# EAGLE design roundboard - MDBT42Q_ICM20848_new (EAGLE 9.6.2)
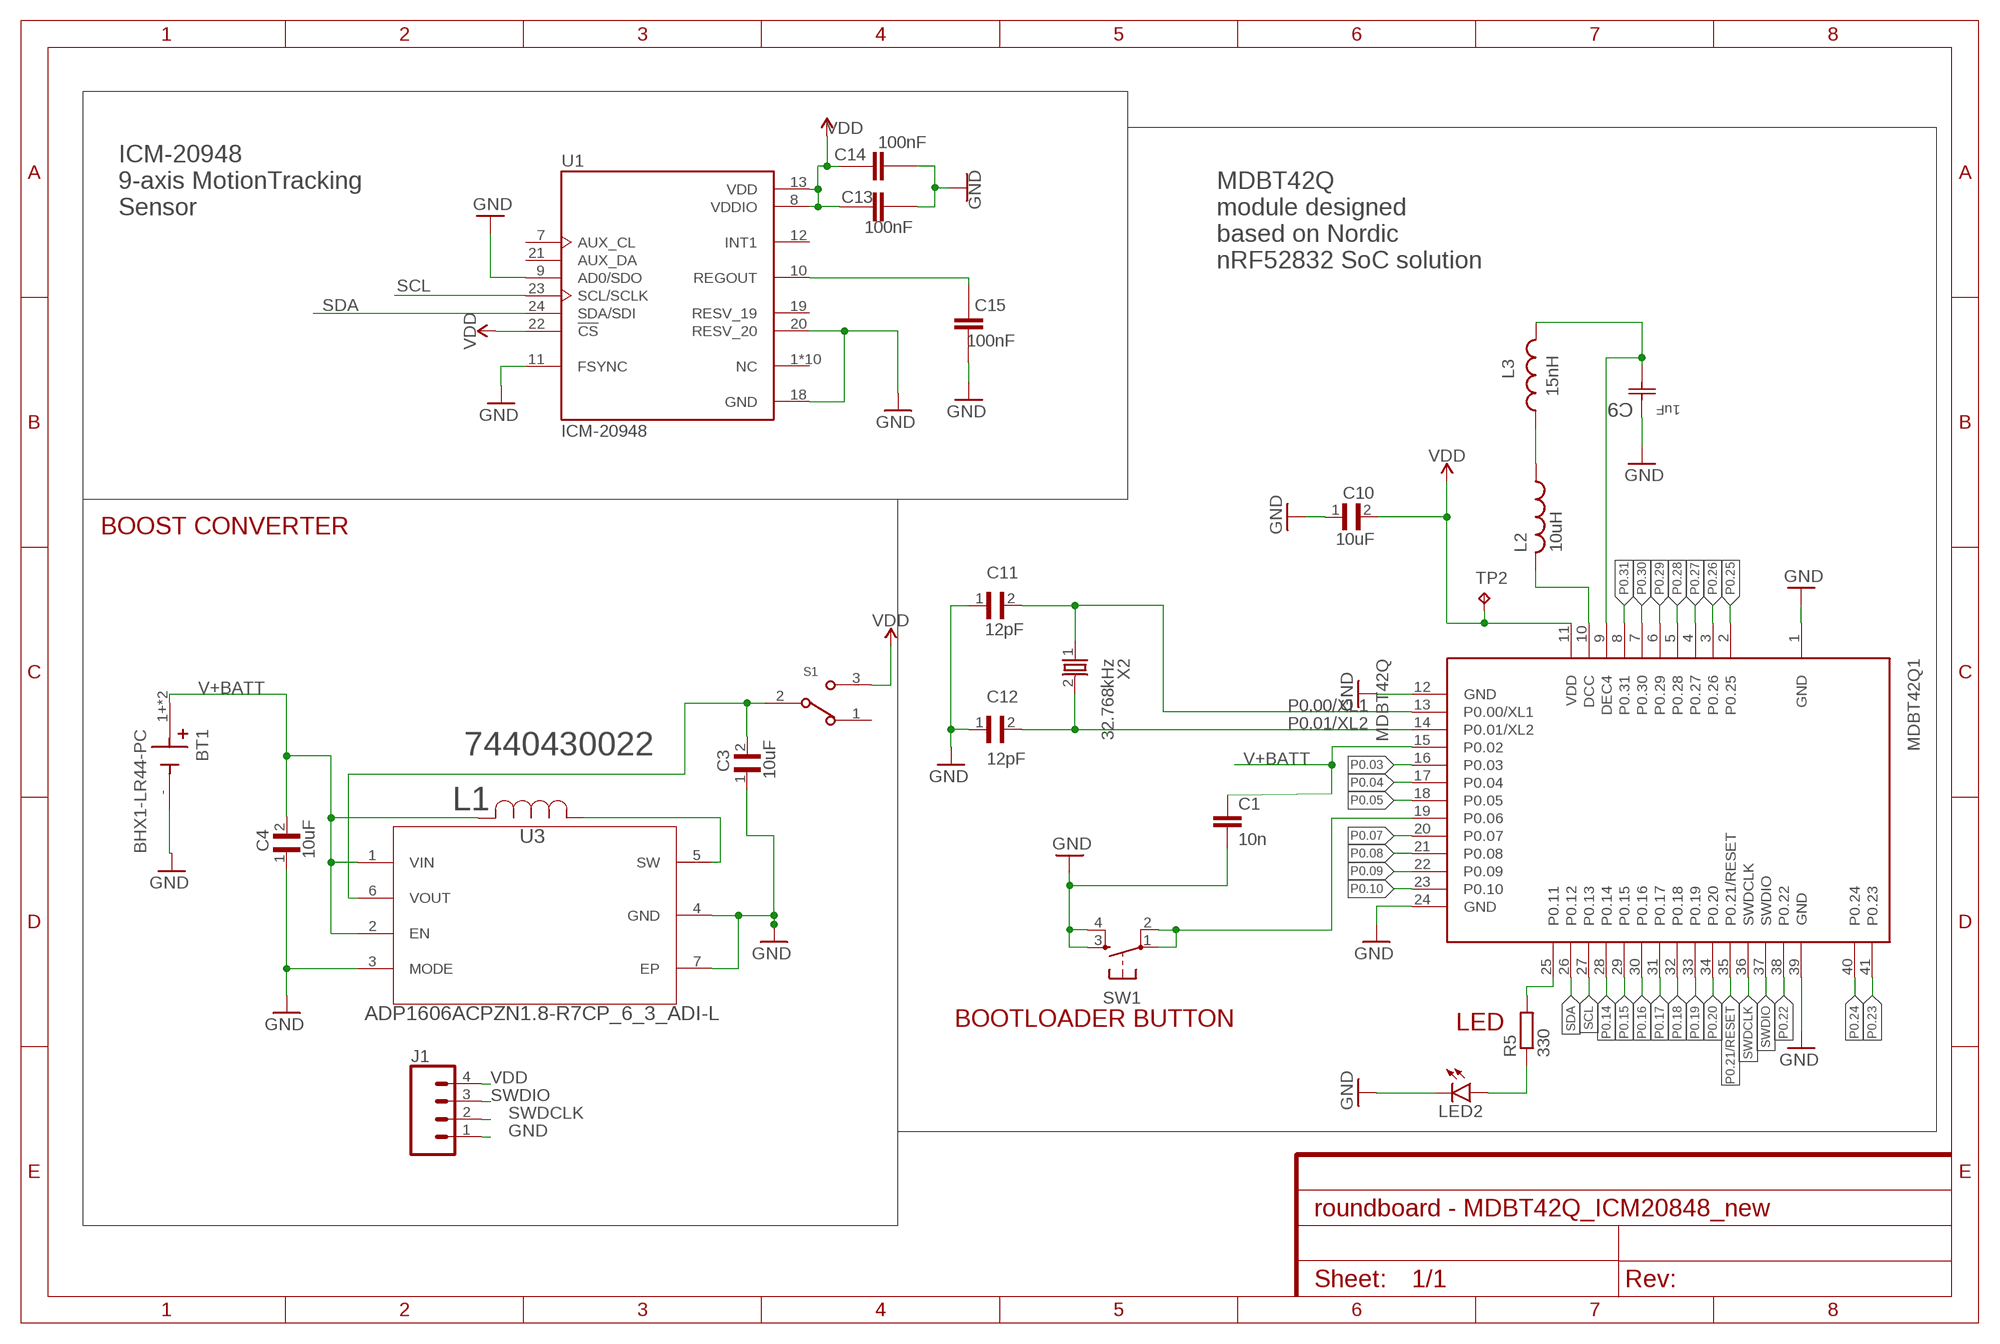
[diagram p0: schematic, sheet 1]

## Parts
BT1  BHX1-LR44-PC  [BAT_BHX1-LR44-PC]
C1  10n  C-EUC0603  [C0603]
C3  10uF  GRM188R61A106KE69J  [CAPC1608X95N]
C4  10uF  GRM188R61A106KE69J  [CAPC1608X95N]
C9  1uF  CC0603KRX7R7BB105  [CAPC1608X90N]
C10  10uF  GRM188R61A106KE69J  [CAPC1608X95N]
C11  12pF  04025A120GAT2A  [CAPC1005X56N]
C12  12pF  04025A120GAT2A  [CAPC1005X56N]
C13  100nF  CC0402KRX7R6BB104  [CAPC1005X60]
C14  100nF  CC0402KRX7R6BB104  [CAPC1005X60]
C15  100nF  CC0402KRX7R6BB104  [CAPC1005X60]
J1  CONN_04PTH  [1X04]
L1  7440430022  [IND_7440430022_WRE]
L2  10uH  INDUCTOR_0603_L  [RESC0603_L]
L3  15nH  LQG15HS15NJ02D  [INDC1005X55N]
LED2  LEDCHIPLED_0603  [CHIPLED_0603]
MDBT42Q1  MDBT42Q  [MDBT42Q]
R5  330  R-EU_R0603  [R0603]
S1  JS102011SAQN  [SW_JS102011SAQN]
SW1  SWITCH_SPST_4_PINRECT  [TACTILE_SWITCH_SMD_4.6X2.8MM]
TP2  TPB1,27  [B1,27]
U1  ICM-20948  [QFN40P300X300X105-24N]
U3  ADP1606ACPZN1.8-R7CP_6_3_ADI-L  [CP_6_3_ADI-L]
X2  32.768kHz  XTAL_32KHZ  [XTAL_3215_N]

## Nets
GND: BT1.- C1.2 C3.1 C4.1 C9.1(C1) C10.1 C11.1 C12.1 C13.1 C14.1 C15.1 J1.1 LED2.C MDBT42Q1.1(GND) MDBT42Q1.12(GND) MDBT42Q1.24(GND) MDBT42Q1.39(GND) SW1.3 SW1.4 U1.9(AD0/SDO) U1.11(FSYNC) U1.18(GND) U1.20(RESV_20) U3.3(MODE) U3.4(GND) U3.7(EP)
IND: L1.1 U3.5(SW)
N$1: LED2.A R5.1
N$2: L2.2 MDBT42Q1.10(DCC)
N$3: L2.1 L3.1
N$4: C9.2(C2) L3.2 MDBT42Q1.9(DEC4)
N$5: MDBT42Q1.25(P0.11) R5.2
N$7: C15.2 U1.10(REGOUT)
P0.00/XL1: C11.2 MDBT42Q1.13(P0.00/XL1) X2.1
P0.01/XL2: C12.2 MDBT42Q1.14(P0.01/XL2) X2.2
P0.03: MDBT42Q1.16(P0.03)
P0.04: MDBT42Q1.17(P0.04)
P0.05: MDBT42Q1.18(P0.05)
P0.07: MDBT42Q1.20(P0.07)
P0.08: MDBT42Q1.21(P0.08)
P0.09: MDBT42Q1.22(P0.09)
P0.10: MDBT42Q1.23(P0.10)
P0.14: MDBT42Q1.28(P0.14)
P0.15: MDBT42Q1.29(P0.15)
P0.16: MDBT42Q1.30(P0.16)
P0.17: MDBT42Q1.31(P0.17)
P0.18: MDBT42Q1.32(P0.18)
P0.19: MDBT42Q1.33(P0.19)
P0.20: MDBT42Q1.34(P0.20)
P0.21/RESET: MDBT42Q1.35(P0.21/RESET)
P0.22: MDBT42Q1.38(P0.22)
P0.23: MDBT42Q1.41(P0.23)
P0.24: MDBT42Q1.40(P0.24)
P0.25: MDBT42Q1.2(P0.25)
P0.26: MDBT42Q1.3(P0.26)
P0.27: MDBT42Q1.4(P0.27)
P0.28: MDBT42Q1.5(P0.28)
P0.29: MDBT42Q1.6(P0.29)
P0.30: MDBT42Q1.7(P0.30)
P0.31: MDBT42Q1.8(P0.31)
P06: MDBT42Q1.19(P0.06) SW1.1 SW1.2
SCL: MDBT42Q1.27(P0.13) U1.23(SCL/SCLK)
SDA: MDBT42Q1.26(P0.12) U1.24(SDA/SDI)
SW: C3.2 S1.2 U3.6(VOUT)
SWDCLK: J1.2 MDBT42Q1.36(SWDCLK)
SWDIO: J1.3 MDBT42Q1.37(SWDIO)
V+BATT: BT1.1+(+) BT1.2+(+) C1.1 C4.2 L1.2 MDBT42Q1.15(P0.02) U3.1(VIN) U3.2(EN)
VDD: C10.2 C13.2 C14.2 J1.4 MDBT42Q1.11(VDD) S1.3 TP2.TP U1.8(VDDIO) U1.13(VDD) U1.22(!CS)
Unconnected: S1.1 U1.1(NC) U1.2(NC) U1.3(NC) U1.4(NC) U1.5(NC) U1.6(NC) U1.7(AUX_CL) U1.12(INT1) U1.14(NC) U1.15(NC) U1.16(NC) U1.17(NC) U1.19(RESV_19) U1.21(AUX_DA)

## Notes on the sheet
- ICM-20948
  9-axis MotionTracking
  Sensor
- MDBT42Q
  module designed 
  based on Nordic 
  nRF52832 SoC solution
- BOOST CONVERTER
- BOOTLOADER BUTTON | LED

## Library data of the parts
BT1 = BHX1-LR44-PC:BHX1-LR44-PC: Battery Retainer Coin, 12.0mm 1 Cell PC Pin; DESCRIPTION: Battery Retainer Coin, 12.0mm 1 Cell PC Pin; DIGI-KEY_PART_NUMBER: BHX1-LR44-PC-G-ND; MF: MPD; MP: BHX1-LR44-PC; PACKAGE: None; PURCHASE-URL: https://pricing.snapeda.com/search/part/BHX1-LR44-PC/?ref=eda
C1 = rcl:C-EU: CAPACITOR, European symbol; SPICEPREFIX: C
C3 C4 C10 = GRM188R61A106KE69J:GRM188R61A106KE69J: Cap Ceramic 10uF 10V X5R 10% SMD 0603 85°C Paper T/R; DESCRIPTION: SMD Capacitor X5R_EIA_ with Capacitance: 10uF Tol. 10%. Rated Voltage: 10Vdc; DIGI-KEY_PART_NUMBER: 490-14372-1-ND; DIGI-KEY_PURCHASE_URL: https://www.digikey.com/product-detail/en/murata-electronics/GRM188R61A106KE69J/490-14372-1-ND/6606833?utm_source=snapeda&utm_medium=aggregator&utm_campaign=symbol; MF: Murata; MP: GRM188R61A106KE69J; PACKAGE: 1608 Murata
C9 = CC0603KRX7R7BB105:CC0603KRX7R7BB105: CAPACITOR, 0603; DESCRIPTION: 0603 1 uF 16 V ±10 % Tolerance X7R SMT Multilayer Ceramic Capacitor; DIGI-KEY_PART_NUMBER: 311-1446-1-ND; DIGI-KEY_PURCHASE_URL: https://www.digikey.com/product-detail/en/yageo/CC0603KRX7R7BB105/311-1446-1-ND/2833752?utm_source=snapeda&utm_medium=aggregator&utm_campaign=symbol; MF: Yageo; MP: CC0603KRX7R7BB105; PACKAGE: 0603 Yageo
C11 C12 = 04025A120GAT2A:04025A120GAT2A: CAP, MLCC, C0G, 12PF, 50V, 0402; DESCRIPTION: 0402 12 pF 50 V ±2% Tolerance C0G/NP0 SMT Multilayer Ceramic Capacitor; DIGI-KEY_PART_NUMBER: 478-7871-1-ND; DIGI-KEY_PURCHASE_URL: https://www.digikey.com/product-detail/en/avx-corporation/04025A120GAT2A/478-7871-1-ND/3881494?utm_source=snapeda&utm_medium=aggregator&utm_campaign=symbol; MF: AVX; MP: 04025A120GAT2A; PACKAGE: 1005 AVX
C13-C15 = CC0402KRX7R6BB104:CC0402KRX7R6BB104: Capacitor 100nF 10V 0402 SMD X7R (reel); DESCRIPTION: 0.1µF ±10% 10V Ceramic Capacitor X7R 0402 _1005 Metric_; DIGI-KEY_PART_NUMBER: 311-1345-1-ND; DIGI-KEY_PURCHASE_URL: https://www.digikey.com/product-detail/en/yageo/CC0402KRX7R6BB104/311-1345-1-ND/2103129?utm_source=snapeda&utm_medium=aggregator&utm_campaign=symbol; MF: Yageo; MP: CC0402KRX7R6BB104; PACKAGE: 0402 Yageo
J1 = SparkFun-Connectors:CONN_04: Multi connection point. Often used as Generic Header-pin footprint for 0.1 inch spaced/style header connections On any of the 0.1 inch spaced packages, you can populate with these: Break Away Headers - Straight <https://www.sparkfun.com/products/116> (PRT-00116) Break Away Male Headers - Right Angle <https://www.sparkfun.com/products/553> (PRT-00553) Female Headers <https://www.sparkfun.com/products/115> (PRT-00115) Break Away Headers - Machine Pin <https://www.sparkfun.com/products/117> (PRT-00117) Break Away Female Headers - Swiss Machine Pin <https://www.sparkfun.com/products/743> (PRT-00743) For SCREWTERMINALS and SPRING TERMINALS visit here: Screw Terimnals on SparkFun.com <https://www.sparkfun.com/search/results?term=Screw+Terminals> (5mm/3.5mm/2.54mm spacing) This device is also useful as a general connection point to wire up your design to another part of your project. Our various solder wires solder well into these plated through hole pads. Hook-Up Wire - Assortment (Stranded, 22 AWG) <https://www.sparkfun.com/products/11375> (PRT-11375) Hook-Up Wire - Assortment (Solid Core, 22 AWG) <https://www.sparkfun.com/products/11367> (PRT-11367) View the entire wire category on our website here <https://www.sparkfun.com/categories/141> Special notes: Molex polarized connector foot print use with SKU : PRT-08231 with associated crimp pins and housings. 1MM SMD Version SKU: PRT-10208; PROD_ID: CONN-09696
L1 = inductor:7440430022; BUILT_BY: EMA_Cory; COPYRIGHT: Copyright (C) 2018 Accelerated Designs. All rights reserved; DATASHEET: https://www.we-online.de/katalog/datasheet/7440430022.pdf; MANUFACTURER_PART_NUMBER: 7440430022; SOURCELIBRARY: Wurth_Electronics_2020-07-24; VENDOR: Wurth Electronics
L2 = Nordic_nRF:INDUCTOR: Generic chip inductor
L3 = LQG15HS15NJ02D:LQG15HS15NJ02D: Ind RF Chip Multi-Layer 15nH 5% 100MHz 8Q-Factor Air 300mA 0402 Paper T/R; DESCRIPTION: Inductor with Inductance: 15nH Tol. +/-5%, Package: 0402 _1005_; DIGI-KEY_PART_NUMBER: 490-2625-1-ND; DIGI-KEY_PURCHASE_URL: https://www.digikey.com/product-detail/en/murata-electronics/LQG15HS15NJ02D/490-2625-1-ND/662905?utm_source=snapeda&utm_medium=aggregator&utm_campaign=symbol; MF: Murata Electronics; MP: LQG15HS15NJ02D; PACKAGE: 1005 Murata
LED2 = led:LED: LED OSRAM: - CHIPLED LG R971, LG N971, LY N971, LG Q971, LY Q971, LO R971, LY R971 LH N974, LH R974 LS Q976, LO Q976, LY Q976 LO Q996 - Hyper CHIPLED LW Q18S LB Q993, LB Q99A, LB R99A - SideLED LS A670, LO A670, LY A670, LG A670, LP A670 LB A673, LV A673, LT A673, LW A673 LH A674 LY A675 LS A676, LA A676, LO A676, LY A676, LW A676 LS A679, LY A679, LG A679 - Hyper Micro SIDELED® LS Y876, LA Y876, LO Y876, LY Y876 LT Y87S - SmartLED LW L88C, LW L88S LB L89C, LB L89S, LG L890 LS L89K, LO L89K, LY L89K LS L896, LA L896, LO L896, LY L896 - TOPLED LS T670, LO T670, LY T670, LG T670, LP T670 LSG T670, LSP T670, LSY T670, LOP T670, LYG T670 LG T671, LOG T671, LSG T671 LB T673, LV T673, LT T673, LW T673 LH T674 LS T676, LA T676, LO T676, LY T676, LB T676, LH T676, LSB T676, LW T676 LB T67C, LV T67C, LT T67C, LS T67K, LO T67K, LY T67K, LW E67C LS E67B, LA E67B, LO E67B, LY E67B, LB E67C, LV E67C, LT E67C LW T67C LS T679, LY T679, LG T679 LS T770, LO T770, LY T770, LG T770, LP T770 LB T773, LV T773, LT T773, LW T773 LH T774 LS E675, LA E675, LY E675, LS T675 LS T776, LA T776, LO T776, LY T776, LB T776 LHGB T686 LT T68C, LB T68C - Hyper Mini TOPLED® LB M676 - Mini TOPLED Santana® LG M470 LS M47K, LO M47K, LY M47K Source: http://www.osram.convergy.de LUXEON: - LUMILED® LXK2-PW12-R00, LXK2-PW12-S00, LXK2-PW14-U00, LXK2-PW14-V00 LXK2-PM12-R00, LXK2-PM12-S00, LXK2-PM14-U00 LXK2-PE12-Q00, LXK2-PE12-R00, LXK2-PE12-S00, LXK2-PE14-T00, LXK2-PE14-U00 LXK2-PB12-K00, LXK2-PB12-L00, LXK2-PB12-M00, LXK2-PB14-N00, LXK2-PB14-P00, LXK2-PB14-Q00 LXK2-PR12-L00, LXK2-PR12-M00, LXK2-PR14-Q00, LXK2-PR14-R00 LXK2-PD12-Q00, LXK2-PD12-R00, LXK2-PD12-S00 LXK2-PH12-R00, LXK2-PH12-S00 LXK2-PL12-P00, LXK2-PL12-Q00, LXK2-PL12-R00 Source: www.luxeon.com KINGBRIGHT: KA-3528ASYC Source: www.kingbright.com
MDBT42Q1 = MDBT42Q_171016:MDBT42Q: Raytac Corporation MDBT42Q-512K, MDBT42Q-P512K Bluetooth Low Energy Module based on Noridc nRF52832 Source: Raytac datasheet
R5 = rcl:R-EU_: RESISTOR, European symbol; SPICEPREFIX: R
S1 = JS102011SAQN:JS102011SAQN: JS10 Series SPDT On-On 6 V 0.3 A Gull Wing SMT Slide Switch http://www.snapeda.com/parts/JS102011SAQN/C%26K%20Components/view-part/; DESCRIPTION: Slide Switch SPDT Surface Mount, Right Angle; DIGI-KEY_PART_NUMBER: 401-1999-1-ND; DIGI-KEY_PURCHASE_URL: https://www.digikey.com/product-detail/en/c-k/JS102011SAQN/401-1999-1-ND/1640114?utm_source=snapeda&utm_medium=aggregator&utm_campaign=symbol; MF: C&K; MP: JS102011SAQN; PACKAGE: None
SW1 = SparkFun-Electromechanical:SWITCH_SPST_4_PIN; PROD_ID: SWCH-13065
TP2 = testpad:TP: Test pad
U1 = ICM-20948:ICM-20948: Accelerometer, Gyroscope, Magnetometer, 9 Axis Sensor I²C, SPI Output Check prices <https://pricing.snapeda.com/parts/ICM-20948/TDK%20InvenSense/view-part?ref=eda>; AVAILABILITY: Good; DESCRIPTION: Accelerometer, Gyroscope, Magnetometer, 9 Axis Sensor I²C, SPI Output; MF: TDK InvenSense; MP: ICM-20948; PACKAGE: TFQFN-24 TDK InvenSense; PRICE: None; PURCHASE-URL: https://pricing.snapeda.com/search/part/ICM-20948/?ref=eda
U3 = AD1606:ADP1606ACPZN1.8-R7; BUILT_BY: EMA_UL_Team; MANUFACTURER_PART_NUMBER: ADP1606ACPZN1.8-R7; SOURCELIBRARY: Analog_2015-12-15; VENDOR: Analog Devices Inc
X2 = Nordic_nRF:XTAL_32KHZ

## Board
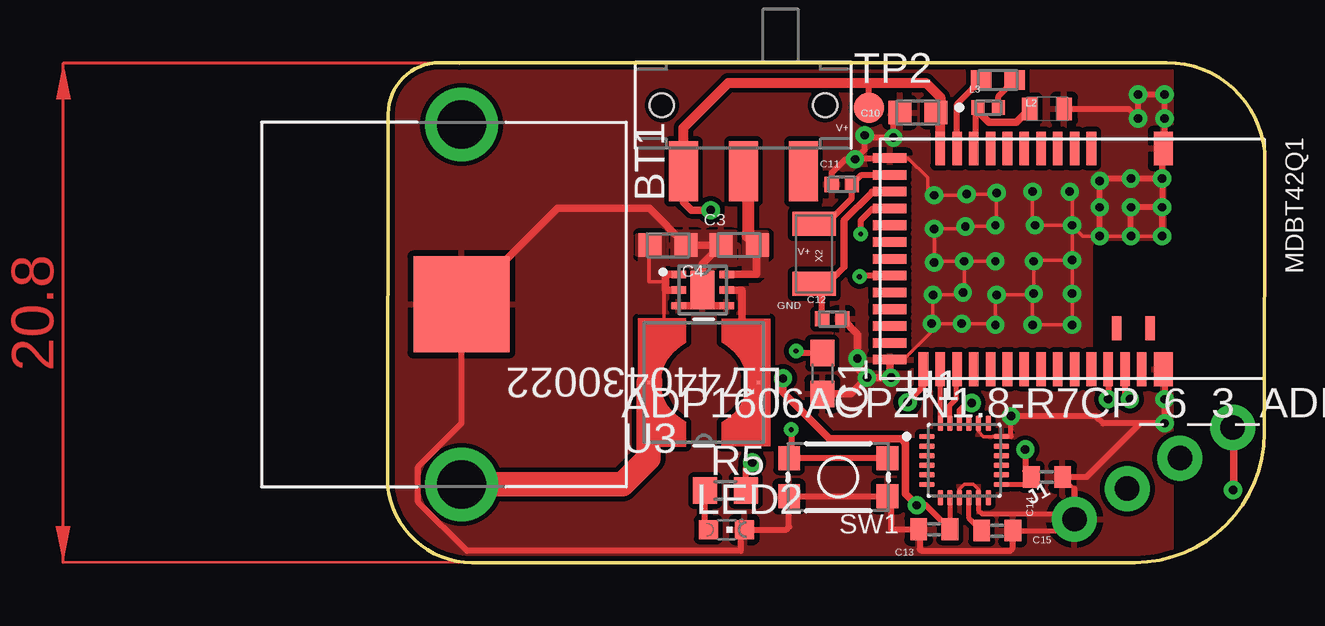
[diagram p1: board, top side]
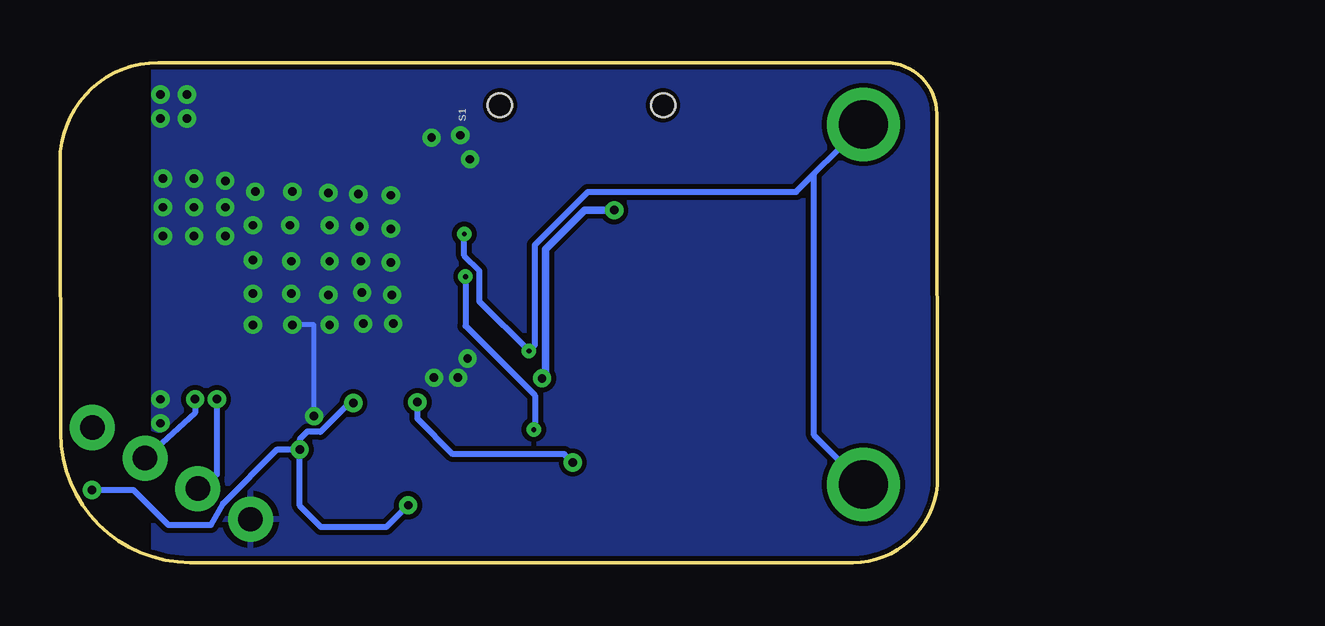
[diagram p2: board, bottom side, seen from below]

Size 36.58 x 20.83 mm. Coordinates in mm from the lower left corner, seen from the top.
Outline: 2.17,20.83 32.49,20.83 arc-90 36.58,16.73 36.56,5.39 arc-90 31.15,0 3.53,0 arc-90 0,3.54 0.04,18.7 arc-90 2.17,20.83
Copper layers (1*16): Top 0.035mm / dielectric 1.5mm / Bottom 0.035mm
Design rules "mdsrl": minimum track width 6mil, minimum drill 0.2mm, track to track 6mil, track to pad 6mil, pad to pad 6mil, via to via 6mil, smd to smd 6mil, copper to edge 8mil, drill to drill 6mil, minimum pad ring 10mil, minimum via ring 8mil, stop-mask expansion 10mil, vias tented up to drill 0mil, thermal gap 10mil

### Footprints (pad centres in the part's own frame; a part is rotated, then mirrored left to right if it is on the bottom)
BAT_BHX1-LR44-PC = drill 2.03: 1+ -7.5,0; 2+ 7.5,0 | smd 4 x 4: - 0,0
C0603 = smd 1.1 x 1: 1 -0.85,0; 2 0.85,0
CAPC1608X95N = smd 0.96 x 0.97: 1 -0.755,0; 2 0.755,0
CAPC1608X90N = smd 0.66 x 0.94: 1 -0.711,0; 2 0.711,0
CAPC1005X56N = smd 0.59 x 0.63: 1 -0.42,0; 2 0.42,0
CAPC1005X60 = smd 0.7 x 0.9: 1 -0.65,0; 2 0.65,0
1X04 = drill 1.016 pad 1.88: 1 0,0; 2 2.54,0; 3 5.08,0; 4 7.62,0
IND_7440430022_WRE = smd 0.127 x 0.127: 1 -2.286,0; 2 2.286,0
RESC0603_L = smd 0.85 x 0.8: 1 -0.7,0; 2 0.7,0
INDC1005X55N = smd 0.54 x 0.6: 1 -0.432,0; 2 0.432,0
CHIPLED_0603 = smd 0.8 x 0.8: A 0,-0.75; C 0,0.75
MDBT42Q = smd 1.4 x 0.8: 1 -4.6,3.8; 39 4.6,3.8 | smd 1.4 x 0.4: 2 -4.6,0.8; 3 -4.6,0.1; 4 -4.6,-0.6; 5 -4.6,-1.3; 6 -4.6,-2; 7 -4.6,-2.7; 8 -4.6,-3.4; 9 -4.6,-4.1; 10 -4.6,-4.8; 11 -4.6,-5.5; 25 4.6,-6.2; 26 4.6,-5.5; 27 4.6,-4.8; 28 4.6,-4.1; 29 4.6,-3.4; 30 4.6,-2.7; 31 4.6,-2; 32 4.6,-1.3; 33 4.6,-0.6; 34 4.6,0.1; 35 4.6,0.8; 36 4.6,1.5; 37 4.6,2.2; 38 4.6,2.9 | smd 0.4 x 1.4: 12 -4.2,-7.6; 13 -3.5,-7.6; 14 -2.8,-7.6; 15 -2.1,-7.6; 16 -1.4,-7.6; 17 -0.7,-7.6; 18 0,-7.6; 19 0.7,-7.6; 20 1.4,-7.6; 21 2.1,-7.6; 22 2.8,-7.6; 23 3.5,-7.6; 24 4.2,-7.6 | smd 1 x 0.4: 40 2.9,3.25; 41 2.9,1.85
R0603 = smd 1 x 1.1: 1 -0.85,0; 2 0.85,0
SW_JS102011SAQN = smd 1.2 x 2.5: 1 -2.5,2.75; 2 0,2.75; 3 2.5,2.75 | hole 1: -3.4,0; 3.4,0
TACTILE_SWITCH_SMD_4.6X2.8MM = smd 0.9 x 1: 1 -2.05,-0.8; 2 2.05,-0.8; 3 2.05,0.8; 4 -2.05,0.8
B1,27 = smd 1.27 x 1.27: TP 0,0
QFN40P300X300X105-24N = smd 0.64 x 0.22: 1 -1.545,1; 2 -1.545,0.6; 3 -1.545,0.2; 4 -1.545,-0.2; 5 -1.545,-0.6; 6 -1.545,-1; 13 1.545,-1; 14 1.545,-0.6; 15 1.545,-0.2; 16 1.545,0.2; 17 1.545,0.6; 18 1.545,1 | smd 0.22 x 0.64: 7 -1,-1.545; 8 -0.6,-1.545; 9 -0.2,-1.545; 10 0.2,-1.545; 11 0.6,-1.545; 12 1,-1.545; 19 1,1.545; 20 0.6,1.545; 21 0.2,1.545; 22 -0.2,1.545; 23 -0.6,1.545; 24 -1,1.545
CP_6_3_ADI-L = smd 0.61 x 0.299: 1 -1,0.65; 2 -1,0; 3 -1,-0.65; 4 1,-0.65; 5 1,0; 6 1,0.65 | smd 1 x 1.6: 7 0,0
XTAL_3215_N = smd 1 x 1.8: 1 -1.25,0; 2 1.25,0

### Placement (x,y rotation side)
BT1  3.09,10.75 270 top
C1  18.13,7.87 270 top
C3  14.67,13.23 0 top
C4  11.69,13.23 180 top
C9  27.49,18.9 180 top
C10  22.12,18.75 0 top
C11  18.94,15.75 0 top
C12  18.54,10.15 180 top
C13  22.79,1.39 0 top
C14  27.49,3.57 180 top
C15  25.42,1.33 180 top
J1  28.64,1.8 30.1 top
L1  13.19,7.5 180 top
L2  25.44,20.1 180 top
L3  25.04,18.95 180 top
LED2  14.13,1.37 270 top
MDBT42Q1  28.54,12.65 270 top
R5  14.09,3 0 top
S1  14.84,19.05 180 top
SW1  18.79,3.55 180 top
TP2  20.07,18.95 0 top
U1  24.04,4.25 0 top
U3  13.14,11.35 0 top
X2  17.79,12.86 270 top

### Tracks (layer width: path | path; a pad name or v marks a point on that pad's centre or on a via)
GND  (via drill 0.35)
  Top 0.152: MDBT42Q1.39 32.41,7.98 | MDBT42Q1.24 21.51,8.45 22.69,9.63 22.69,9.9 | 22.69,9.9 v22.69,9.95 v23.94,9.95 25.29,9.95 v25.34,9.9 25.34,11.1 v25.39,11.15 26.89,11.15 | 22.69,9.9 22.74,9.95 v22.74,11.15 23.89,11.15 v23.99,11.25 24.04,11.3 v24.04,12.55 | v24.04,12.55 22.84,12.55 v22.79,12.5 v22.79,13.9 23.99,13.9 v24.09,14 25.29,14 v25.34,14.05 25.39,14.1 v25.39,15.4 25.34,15.35 v24.14,15.35 24.09,15.3 v22.79,15.3 22.52,15.57 22.52,16.03 21.7,16.85 20.99,16.85 MDBT42Q1.12 | v24.04,12.55 v25.34,12.55 | 26.89,11.15 v26.89,9.9 v28.54,9.9 v28.54,11.2 v28.54,12.6 | 26.89,11.15 v26.94,11.2 v26.94,12.55 26.99,12.6 v28.54,12.6 | v32.29,13.6 28.99,13.6 v28.54,14.05 | v28.54,14.05 v26.99,14.05 26.89,14.15 v26.89,15.45 | v28.54,14.05 28.54,15.35 v28.44,15.45 | v28.54,14.05 v28.54,12.6 | C14.1 28.64,3.07 | U1.9 23.83,2.72 23.83,3.03 24.05,3.25 24.43,3.25 24.66,3.03 24.66,2.72 U1.11 | U1.20 24.63,5.78 24.63,5.47 24.85,5.25 25.23,5.25 U1.18
  Top 0.203: C15.1 28.37,1.33 J1.1 28.64,2.03 24.79,2.03 24.64,2.18 U1.11 | U1.18 25.99,5.25 v25.99,6.1
  Top 0.254: C11.1 18.52,16.23 19.09,16.8 v19.49,16.8 | 28.64,3.07 J1.1 | v19.49,16.8 19.54,16.85 20.99,16.85 | 32.41,7.98 32.41,6.82 v32.39,6.8 v32.39,5.8 31.39,5.8 | v25.99,6.1 29.54,6.1 29.84,5.8 31.39,5.8 | C15.1 26.07,0.6 25.95,0.48 22.27,0.48 22.19,0.56 22.19,1.34 C13.1 21.01,1.39 21,1.4 21,2.59 SW1.4 SW1.3 16.74,1.48 16.63,1.37 LED2.C 14.73,1.21 14.73,0.48 3.31,0.48 1.29,2.5 1.29,4 3.09,5.8 BT1.- | C14.1 29.15,3.57 31.39,5.8 | C9.1 30.89,18.9 v31.29,18.5 v31.29,19.5 v32.39,19.5 v32.39,18.5 32.39,17.3 MDBT42Q1.1 32.29,17.2 v32.29,16 | v29.69,13.6 v29.69,14.8 v29.69,15.9 29.79,16 v30.99,16 v32.29,16 | v32.29,16 v32.29,14.8 | v32.29,14.8 v30.99,14.8 v30.99,13.6 | v32.29,13.6 v32.29,14.8 | C10.1 21.09,18.48 v21.09,17.7 19.99,17.7 v19.89,17.8 19.89,17.2 v19.49,16.8
  Top 0.305: U3.4 13.14,10.7 | 13.14,10.7 U3.7 13.14,12.45 C3.1 C4.1 10.92,14.76 7.1,14.76 BT1.- | U3.3 13.14,10.7 | MDBT42Q1.24 20.94,7.75 v20.99,7.7 v19.99,7.7 | v19.99,7.7 19.59,8.1 v19.59,8.5 19.59,9.52 C12.1 | C1.2 19.32,7.02 v19.99,7.7
  Bottom 0.203: v25.99,6.1 25.99,9.9 v26.89,9.9
  pour Top (no thermals): 12.73,11.97 13.56,11.97 13.56,12.26 14.5,12.26 14.5,13.81 11.87,13.81 11.87,12.27 12.73,12.27
  pour Bottom (isolate 0.203): 32.66,20.6 0.36,20.6 0.36,0.28 32.66,0.2
  pour Top (isolate 0.203): 0.39,20.6 32.69,20.6 32.69,13.2 29.59,13.2 29.59,8.8 32.59,8.8 32.69,8.8 32.69,0.2 0.39,0.2
IND
  Top 0.254: L1.1 15.48,9.69 15.18,9.98
  Top 0.305: U3.5 14.78,11.35 14.78,9.91 15.08,9.91 15.08,9.98 15.18,9.98
  pour Top: 15.16,9.52 15.39,9.52 15.87,10.01
  pour Top (no thermals): 14.67,11.35 14.62,11.3 14.62,9.98 15.87,9.98 15.87,11.45 14.67,11.45
N$1
  Top 0.254: LED2.A 13.24,1.51 R5.1
N$2
  Top 0.254: MDBT42Q1.10 23.74,19.1 L2.2
N$3
  Top 0.254: L3.1 25.47,19.43 L2.1
N$4
  Top 0.254: L3.2 24.6,18.94 24.52,18.86 24.52,17.33 MDBT42Q1.9
  Top 0.305: C9.2 26.23,18.35 25.08,18.35 24.6,18.82 24.6,18.94
N$5  (via drill 0.35)
  Top 0.254: R5.2 14.94,3.92 15.18,4.16 v15.21,4.16 | v21.68,6.68 22.34,7.34 MDBT42Q1.25
  Bottom 0.254: v15.21,4.16 15.56,4.52 20.21,4.52 21.68,5.99 v21.68,6.68
N$7
  Top 0.203: C15.2 24.24,1.85 U1.10
P0.00/XL1
  Top 0.203: 18.54,14.45 18.64,14.45
  Top 0.254: MDBT42Q1.13 19.76,16.15 C11.2 19.36,15.17 18.64,14.45 | X2.1 18.13,14.45 18.54,14.45
P0.01/XL2
  Top 0.203: 18.74,12 18.99,12.25 18.99,14.25 20.19,15.45
  Top 0.254: 17.98,11.61 X2.2 | C12.2 18.12,11.47 17.98,11.61 | MDBT42Q1.14 20.19,15.45 20.19,15.39 19.06,14.26 19.06,12.32 18.74,12 18.35,11.61 17.98,11.61
P06  (via drill 0.2)
  Top 0.254: SW1.1 16.84,4.35 | 16.84,4.35 SW1.2 | MDBT42Q1.19 19.72,11.95 v19.68,11.91 | v16.83,5.54 16.83,4.36 16.84,4.35
  Bottom 0.254: v19.68,11.91 19.68,9.85 16.78,6.96 16.78,5.56 16.81,5.54 v16.83,5.54
SCL
  Top 0.152: 23.72,8.03 MDBT42Q1.27
  Top 0.203: U1.23 23.44,6.55 23.72,6.83 23.72,8.03
SDA
  Top 0.203: U1.24 MDBT42Q1.26
SW
  Top 0.305: U3.6 15.39,12 15.39,13.23 | 15.39,13.23 15.39,13.25 15.03,13.61 | 15.39,13.23 C3.2 | S1.2 15.03,16.11
  Top 0.508: 15.03,16.11 15.03,13.61
  pour Top (no thermals): 14.85,11.94 14.85,13.79 15.82,13.79 15.82,11.94
SWDCLK  (via drill 0.35)
  Top 0.254: MDBT42Q1.36 v30.04,6.81
  Bottom 0.254: v30.04,6.81 30.04,3.67 J1.2
SWDIO  (via drill 0.35)
  Top 0.254: MDBT42Q1.37 30.74,7.01 v30.95,6.81
  Bottom 0.254: v30.95,6.81 30.95,6.24 J1.3
V+BATT  (via drill 0.2)
  Top 0.152: 11.59,11.7 10.91,11.7 10.91,13.23 C4.2 | 11.59,11.35 11.53,11.35 11.53,10.03
  Top 0.254: MDBT42Q1.15 20.23,14.75 19.73,14.25 v19.73,13.69 | C1.1 17.13,8.72 v17.04,8.81 | L1.2 10.91,9.41 11.53,10.03
  Top 0.305: U3.2 11.59,11.35 11.59,11.7 11.59,12 U3.1
  Top 1.016: BT1.2+ 9.79,3.25 10.89,4.35 10.89,7.49 L1.2
  Bottom 0.254: v19.73,13.69 19.73,12.79 19.1,12.15 19.1,10.87 v17.04,8.81 16.78,9.07 16.78,13.23 14.57,15.44 5.9,15.44 5.15,16.19 | BT1.1+ 4.14,17.2 5.15,16.19 | BT1.2+ 5.15,5.31 5.15,16.19
  pour Top (no thermals): 11.68,10.03 11.68,11.96 11.52,11.96 11.52,13.64 10.38,13.64 10.38,12.83 10.51,12.83 10.51,10.03
VDD  (via drill 0.35)
  Top 0.203: U1.13 26.84,3.25 C14.2 | U1.22 23.84,6.35 24.09,6.6 24.09,6.65 v24.35,6.65 | U1.8 C13.2
  Top 0.254: C13.2 22.44,2.39 v22.07,2.39 | C14.2 26.59,3.82 v26.59,4.71 | TP2.TP 20.07,19.95 20.11,19.99
  Top 0.305: v16.49,7.67 16.49,7.1 18.43,5.16 21.42,5.16 21.6,4.98 21.6,2.86 v22.07,2.39 | J1.4 35.27,5.38 35.27,3.02 v35.25,3.02 | S1.3 12.34,15.01 12.67,14.68 v13.48,14.68
  Top 0.406: MDBT42Q1.11 23.04,18.58 | 23.04,18.58 C10.2 | S1.3 12.34,18.11 14.22,19.99 20.11,19.99 22.45,19.99 23.04,19.39 23.04,18.58
  Bottom 0.254: v22.07,2.39 22.98,1.47 25.7,1.47 26.59,2.36 v26.59,4.71 | v35.25,3.02 33.53,3.02 32.07,1.57 30.3,1.57 30.29,1.57 29.78,2.45 27.52,4.71 v26.59,4.71 | v26.59,4.71 26.59,5.13 26.27,5.45 26.26,5.44 25.72,5.44 24.52,6.65 v24.35,6.65
  Bottom 0.305: v16.49,7.67 16.35,7.81 16.35,13.05 14.73,14.68 v13.48,14.68
(copper drawn outside any net)
  shapes: Top area x1

### Text on the board
tPlace: V+ | V+ | GND